# EAGLE schematic baseExpansion_R1 (EAGLE 7.1.0)
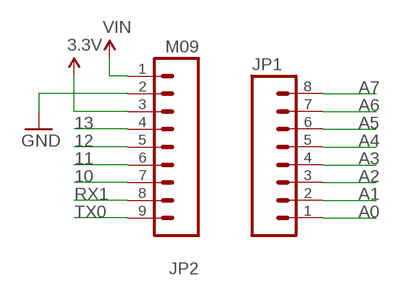
[diagram p0: schematic, sheet 1]

## Parts
JP1  M081X08  [1X08]
JP2  M09  [1X09]

## Nets
3.3V: JP2.3
10: JP2.7
11: JP2.6
12: JP2.5
13: JP2.4
A0: JP1.1
A1: JP1.2
A2: JP1.3
A3: JP1.4
A4: JP1.5
A5: JP1.6
A6: JP1.7
A7: JP1.8
GND: JP2.2
RX1: JP2.8
TX0: JP2.9
VIN: JP2.1

## Library data of the parts
JP1 = SparkFun-Connectors:M08: Header 8 Standard 8-pin 0.1" header. Use with straight break away headers (SKU : PRT-00116), right angle break away headers (PRT-00553), swiss pins (PRT-00743), machine pins (PRT-00117), and female headers (PRT-00115).
JP2 = SparkFun-Connectors:M09: Header 9 Standard 9-pin 0.1" header. Use with straight break away headers (SKU : PRT-00116), right angle break away headers (PRT-00553), swiss pins (PRT-00743), machine pins (PRT-00117), and female headers (PRT-00115).